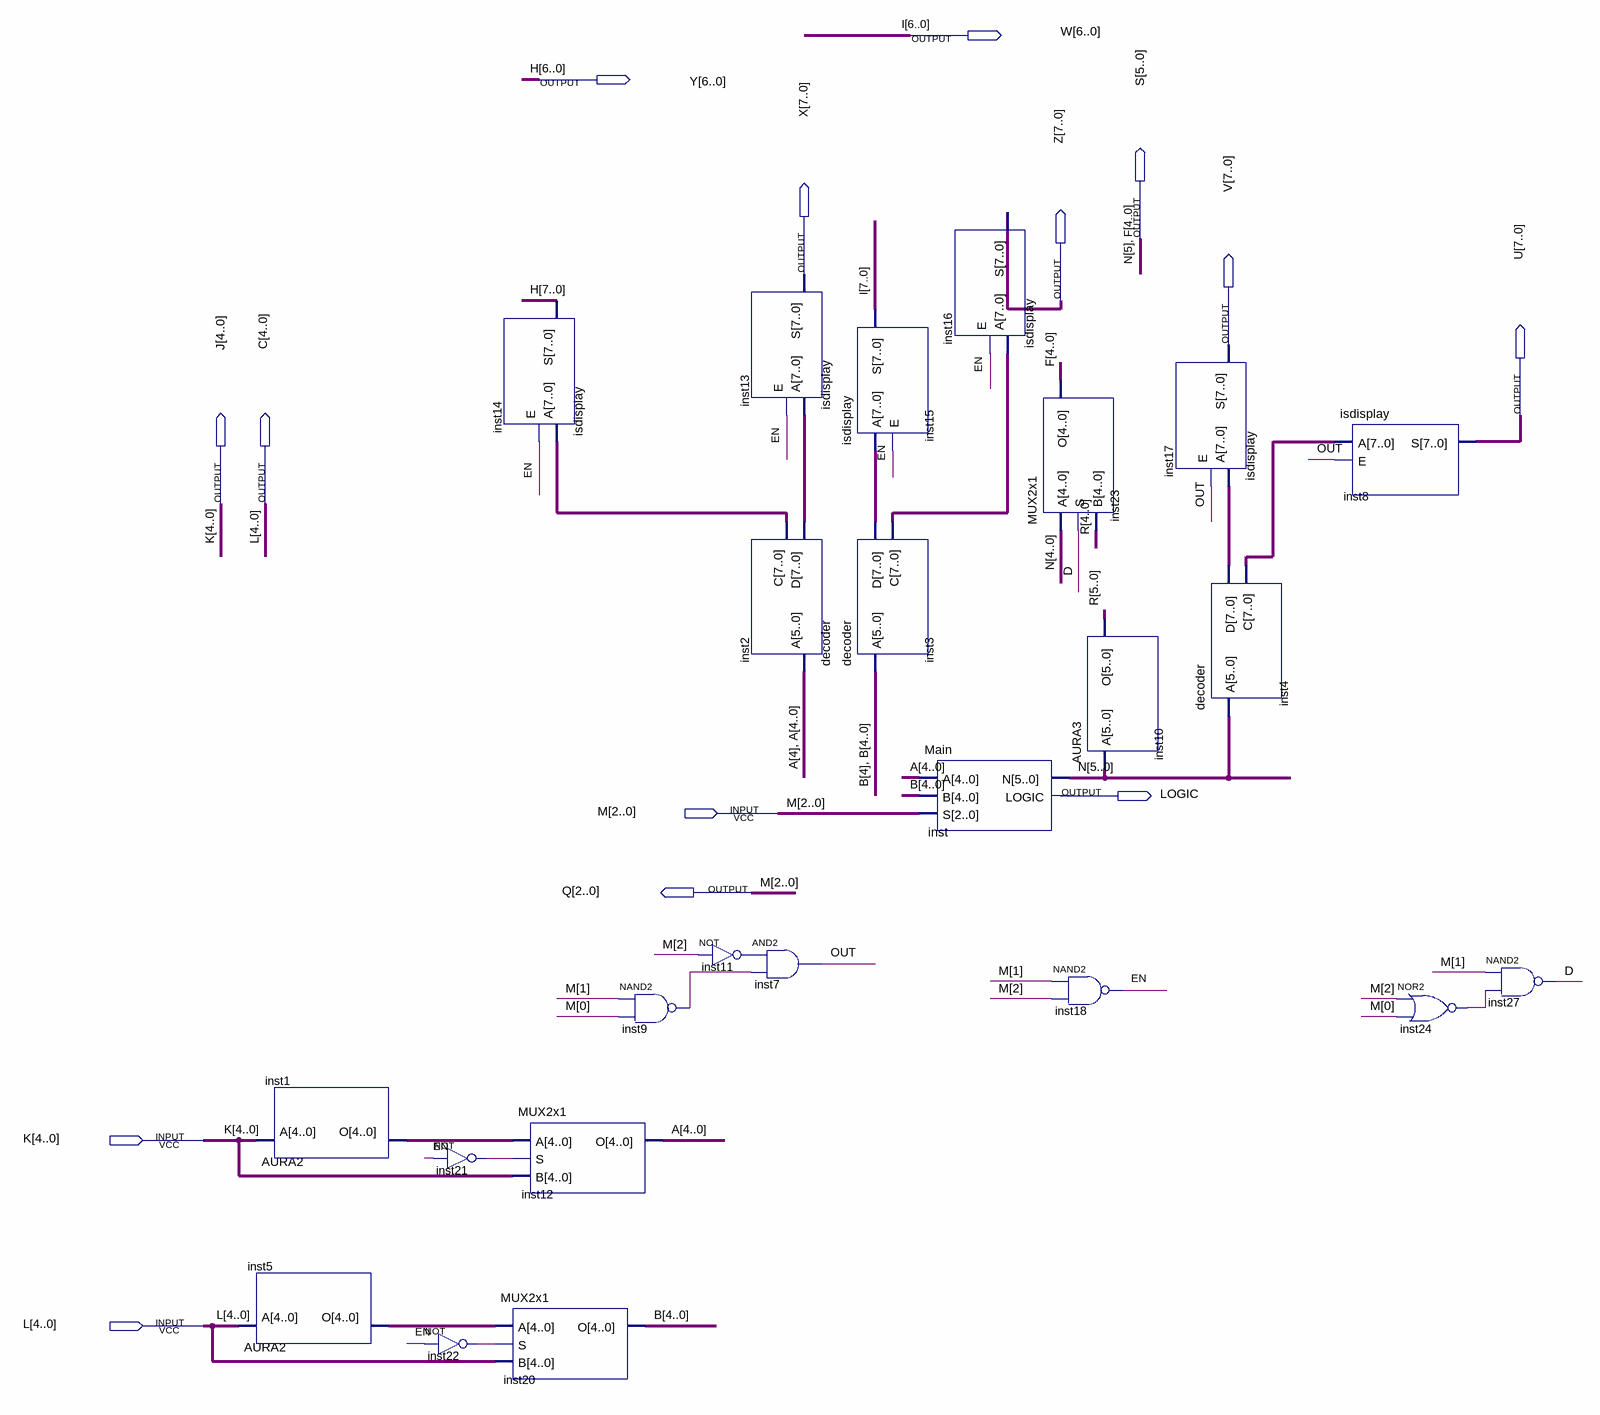
[diagram p0: schematic sheet]
// Quartus schematic THEPROJECT.bdf as structural Verilog: 24 symbols, 14 pins
module THEPROJECT (
  input  [2:0] M,
  input  [4:0] K,
  input  [4:0] L,
  output [6:0] W,
  output [6:0] Y,
  output [5:0] S,
  output [7:0] X,
  output [7:0] Z,
  output [7:0] V,
  output [7:0] U,
  output [4:0] J,
  output [4:0] C,
  output LOGIC,
  output [2:0] Q
);

  wire D, EN, inst9_out, inst11_out, inst21_out, inst22_out, inst24_out, OUT;
  wire [4:0] A, B, inst1_o, inst5_o, N;
  wire [5:0] R;
  wire [7:0] inst2_c, inst2_d, inst3_c, inst3_d, inst4_c, inst4_d;
  wire [7:7] H, I;

  AURA2 inst5 (.A(L), .O(inst5_o));
  AURA2 inst1 (.A(K), .O(inst1_o));
  not inst21 (inst21_out, EN);
  not inst22 (inst22_out, EN);
  isdisplay inst14 (.A(inst2_c), .E(EN), .S({H[7], Y}));
  MUX2x1 inst12 (.A(inst1_o), .S(inst21_out), .B(K), .O(A));
  MUX2x1 inst20 (.A(inst5_o), .S(inst22_out), .B(L), .O(B));
  nand inst9 (inst9_out, M[1], M[0]);
  isdisplay inst13 (.A(inst2_d), .E(EN), .S(X));
  decoder inst2 (.A({{2{A[4]}}, A[3:0]}), .D(inst2_d), .C(inst2_c));
  not inst11 (inst11_out, M[2]);
  and inst7 (OUT, inst11_out, inst9_out);
  isdisplay inst15 (.A(inst3_d), .E(EN), .S({I[7], W}));
  decoder inst3 (.A({{2{B[4]}}, B[3:0]}), .D(inst3_d), .C(inst3_c));
  isdisplay inst16 (.A(inst3_c), .E(EN), .S(Z));
  Main inst (.A(A), .B(B), .S(M), .N({S[5], N}), .LOGIC(LOGIC));
  MUX2x1 inst23 (.A(N), .S(D), .B(R[4:0]), .O(S[4:0]));
  AURA3 inst10 (.A({S[5], N}), .O(R));
  nand inst18 (EN, M[1], M[2]);
  isdisplay inst17 (.A(inst4_d), .E(OUT), .S(V));
  decoder inst4 (.A({S[5], N}), .D(inst4_d), .C(inst4_c));
  isdisplay inst8 (.A(inst4_c), .E(OUT), .S(U));
  nor inst24 (inst24_out, M[2], M[0]);
  nand inst27 (D, M[1], inst24_out);

  assign C = L;
  assign J = K;
  assign Q = M;

  // Other names for the same wires on the sheet: F[4:0] = S[4:0]; H[6:0] = Y; I[6:0] = W; N[5] = S[5]
endmodule
